# Altium schematic sheet MCU.SchDoc
size A4
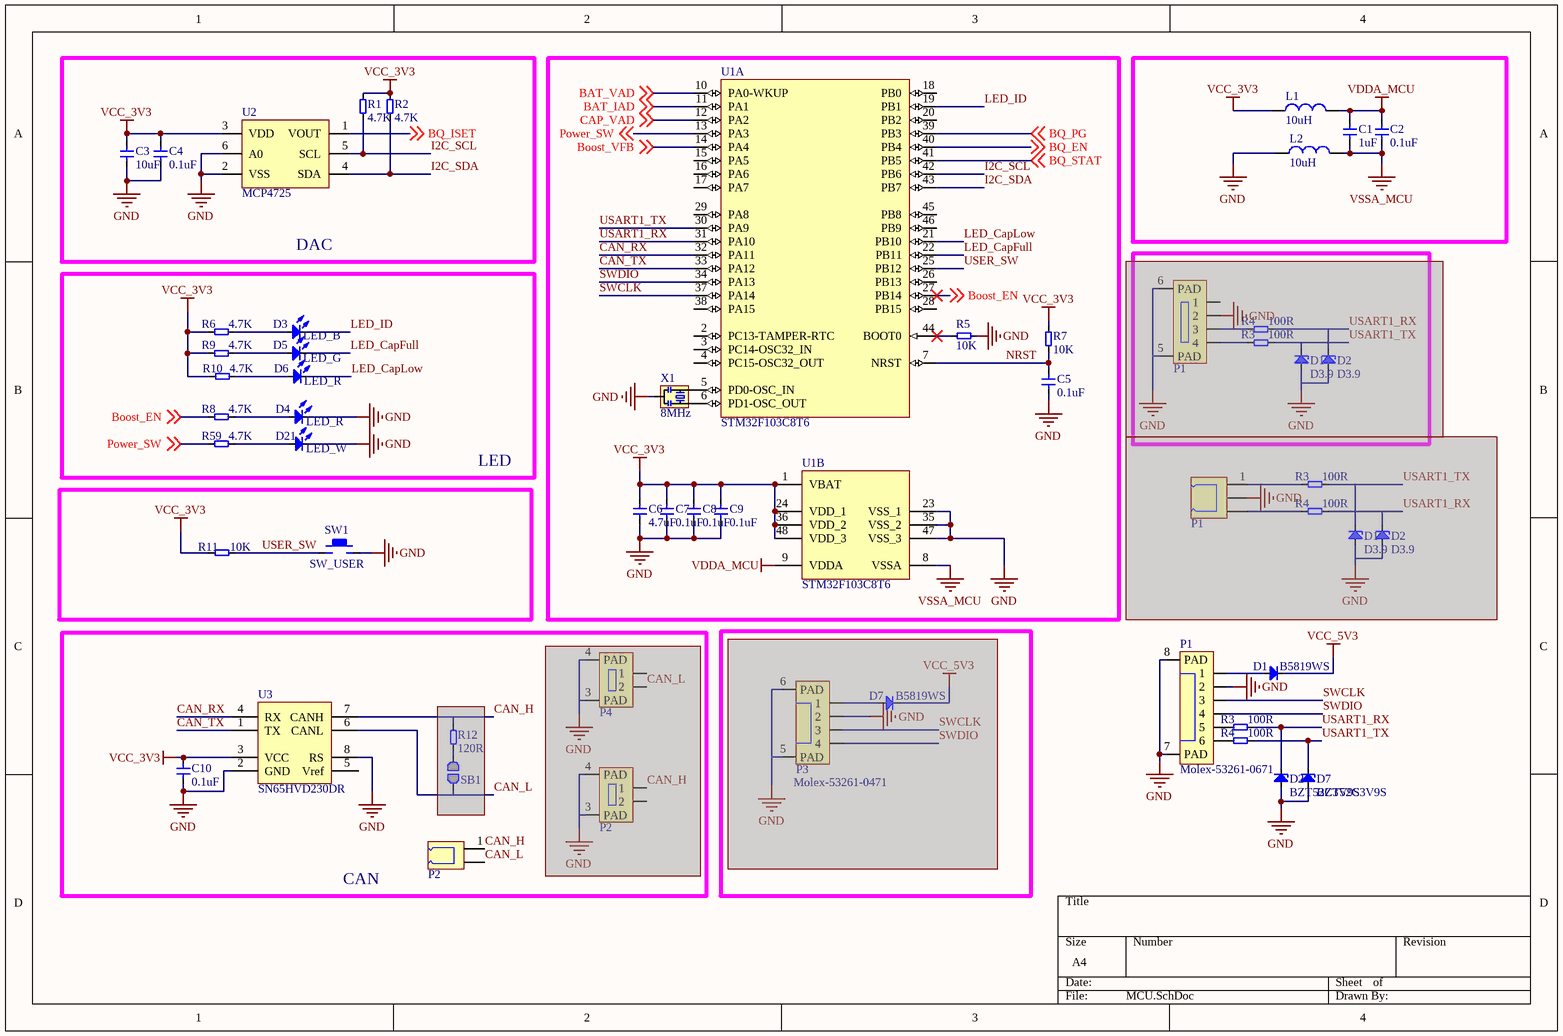
[diagram p0: MCU.SchDoc]

## Parts
(Parts that share a designator on the sheet are numbered #1, #2 ... from top to bottom, then left to right.)
C1  1uF  [CAP-0603-L]
C2  0.1uF  [CAP-0603-L]
C3  10uF  [CAP-0805-L]
C4  0.1uF  [CAP-0603-L]
C5  0.1uF  [CAP-0603-L]
C6  4.7uF  [CAP-0603-L]
C7  0.1uF  [CAP-0603-L]
C8  0.1uF  [CAP-0603-L]
C9  0.1uF  [CAP-0603-L]
C10  0.1uF  [CAP-0603-L]
D1#1  D3.9  [SOD_323]  (masked out: inside a compile mask, not in the netlist)
D1#2  D3.9  [SOD_323]  (masked out: inside a compile mask, not in the netlist)
D1#3  B5819WS  [SOD_323]
D2#1  D3.9  [SOD_323]  (masked out: inside a compile mask, not in the netlist)
D2#2  D3.9  [SOD_323]  (masked out: inside a compile mask, not in the netlist)
D2#3  BZT52C3V9S  [SOD_323]
D3  LED_B  [LED_0603-L]
D4  LED_R  [LED_0603-L]
D5  LED_G  [LED_0603-L]
D6  LED_R  [LED_0603-L]
D7#1  B5819WS  [SOD_323]  (masked out: inside a compile mask, not in the netlist)
D7#2  BZT52C3V9S  [SOD_323]
D21  LED_W  [LED_0603-L]
L1  10uH  [L-0603-L]
L2  10uH  [L-0603-L]
P1#1  GH04  [SM04B-GHS-TB]  (value not drawn)  (masked out: inside a compile mask, not in the netlist)
P1#2  XH_3  [XH_3-sleep]  (value not drawn)  (masked out: inside a compile mask, not in the netlist)
P1#3  Molex-53261-0671  [Molex-53261-0671]
P2#1  GH02  [SM02B-GHS-TB]  (value not drawn)  (masked out: inside a compile mask, not in the netlist)
P2#2  XH_2  [XH_2-SLEEP]  (value not drawn)
P3  Molex-53261-0471  [Molex-53261-0471]  (masked out: inside a compile mask, not in the netlist)
P4  GH02  [SM02B-GHS-TB]  (value not drawn)  (masked out: inside a compile mask, not in the netlist)
R1  4.7K  [R-0603-L]
R2  4.7K  [R-0603-L]
R3#1  100R  [R-0603-L]  (masked out: inside a compile mask, not in the netlist)
R3#2  100R  [R-0603-L]  (masked out: inside a compile mask, not in the netlist)
R3#3  100R  [R-0603-L]
R4#1  100R  [R-0603-L]  (masked out: inside a compile mask, not in the netlist)
R4#2  100R  [R-0603-L]  (masked out: inside a compile mask, not in the netlist)
R4#3  100R  [R-0603-L]
R5  10K  [R-0603-L]
R6  4.7K  [R-0603-L]
R7  10K  [R-0603-L]
R8  4.7K  [R-0603-L]
R9  4.7K  [R-0603-L]
R10  4.7K  [R-0603-L]
R11  10K  [R-0603-L]
R12  120R  [R-0603-L]  (masked out: inside a compile mask, not in the netlist)
R59  4.7K  [R-0603-L]
SB1  Solderbridge  [Solderbridge-0603]  (value not drawn)  (no BOM)  (masked out: inside a compile mask, not in the netlist)
SW1  SW_USER  [KEY-4P-4.2*3.4*2.5]
U1  STM32F103C8T6  [STM-LQFP48_N]  (parts A,B of 2)
U2  MCP4725  [SOT-23-6]
U3  SN65HVD230DR  [SOIC_8]
X1  8MHz  [CSTCE_G(A)村田晶振]

## Blocks framed on the sheet
DAC: C3 C4 R1 R2 U2
LED: D3-D6 D21 R6 R8-R10 R59
CAN: C10 P2#1 P2#2 P4 R12 SB1 U3

## Nets
GND: C3.1 C4.1 C5.1 C6.1 C7.1 C8.1 C9.1 C10.1 D2#3.1 D4.2 D7#2.1 D21.2 L2.1 P1#3.2 P1#3.7(PAD) P1#3.8(PAD) R5.2 SW1.1 U1.23(VSS_1) U1.35(VSS_2) U1.47(VSS_3) U2.2(VSS) U2.6(A0) U3.2(GND) U3.8(RS) X1.2(GND)
VCC_3V3: C3.2 C4.2 C6.2 C7.2 C8.2 C9.2 C10.2 L1.1 R1.2 R2.2 R6.1 R7.2 R9.1 R10.1 R11.1 U1.1(VBAT) U1.24(VDD_1) U1.36(VDD_2) U1.48(VDD_3) U2.3(VDD) U3.3(VCC)
VCC_5V3: D1#3.2
VDDA_MCU: C1.2 C2.2 L1.2 U1.9(VDDA)
VSSA_MCU: C1.1 C2.1 L2.2 U1.8(VSSA)
BAT_IAD: U1.11(PA1) ; off-sheet BAT_IAD
BAT_VAD: U1.10(PA0-WKUP) ; off-sheet BAT_VAD
Boost_EN: R8.1 U1.27(PB14) ; off-sheet Boost_EN
Boost_VFB: U1.14(PA4) ; off-sheet Boost_VFB
BQ_EN: U1.40(PB4) ; off-sheet BQ_EN
BQ_ISET: U2.1(VOUT) ; off-sheet BQ_ISET
BQ_PG: U1.39(PB3) ; off-sheet BQ_PG
BQ_STAT: U1.41(PB5) ; off-sheet BQ_STAT
CAN_H: P2#2.1 U3.7(CANH)
CAN_L: P2#2.2 U3.6(CANL)
CAN_RX: U1.32(PA11) U3.4(RX)
CAN_TX: U1.33(PA12) U3.1(TX)
CAP_VAD: U1.12(PA2) ; off-sheet CAP_VAD
I2C_SCL: R1.1 U1.42(PB6) U2.5(SCL)
I2C_SDA: R2.1 U1.43(PB7) U2.4(SDA)
LED_CapFull: D5.2 U1.22(PB11)
LED_CapLow: D6.2 U1.21(PB10)
LED_ID: D3.2 U1.19(PB1)
NRST: C5.2 R7.1 U1.7(NRST)
Power_SW: R59.1 U1.13(PA3) ; off-sheet Power_SW
SWCLK: P1#3.3 U1.37(PA14)
SWDIO: P1#3.4 U1.34(PA13)
USART1_RX: D2#3.2 R3#3.2 U1.31(PA10)
USART1_TX: D7#2.2 R4#3.2 U1.30(PA9)
USER_SW: R11.2 SW1.2 U1.25(PB12)
NetD1#3_1: D1#3.1 P1#3.1
NetD3_1: D3.1 R6.2
NetD4_1: D4.1 R8.2
NetD5_1: D5.1 R9.2
NetD6_1: D6.1 R10.2
NetD21_1: D21.1 R59.2
NetP1#3_5: P1#3.5 R3#3.1
NetP1#3_6: P1#3.6 R4#3.1
NetR5_1: R5.1 U1.44(BOOT0)
NetU1_5: U1.5(PD0-OSC_IN) X1.1(OSC1)
NetU1_6: U1.6(PD1-OSC_OUT) X1.3(OSC2)

Not connected (* = marked no-connect by the designer): U1 2(PC13-TAMPER-RTC) 3(PC14-OSC32_IN) 4(PC15-OSC32_OUT) 15(PA5) 16(PA6) 17(PA7) 18(PB0) 20(PB2) 26(PB13) 28(PB15) 29(PA8) 38(PA15) 45(PB8) 46(PB9); U3 5(Vref)

## Library data of the parts
C1-C10 = CAP
D1#1 D1#2 D2#1-D2#3 D7#2 = Diode_ZD
D1#3 D7#1 = Diode
D3-D6 D21 = LED
L1 L2 = Inductor: 电感
P1#1 = GHS-M04B: 04GH座
P1#3 = Molex-53261-0671: 1.25mm Pitch PicoBlade Header
P2#1 P4 = GHS-M02B: 02GH座
P3 = Molex-53261-0471: 1.25mm Pitch PicoBlade Header
R1 R2 R3#1-R3#3 R4#1-R4#3 R5-R12 R59 = Res
SW1 = KEY
U1 = STM32F103C8T6: ARM Cortex-M3 32-bit MCU, 64 KB Flash, 20 KB Internal RAM, 37 I/Os, 48-pin LQFP, -40 to 85 degC, Tray; A/D Converter: 2x12-bit (10 Channel); FLASH Size (Prog) (kB): 64; I/Os (High Current): 37; Internal RAM Size (kB): 20; Operating Frequency(F) (Processor speed) (MHz): 72; Supply Voltage(Vcc) min (V): 2; DatasheetVersion: Rev. 16; PackageVersion: Rev. 6, 06/2013; PackageReference: LQFP48; PackageDescription: 48-Pin Low Profile Quad Flat Package, 7 x 7 mm Body, 0.5 mm Pitch; Supplier 1: Digi-Key; Supplier Part Number 1: 497-6063-ND; Supplier 2: Farnell; Supplier Part Number 2: 1447637; Supplier 3: Newark; Supplier Part Number 3: 59M2182; Supplier 4: Newark; Supplier Part Number 4: 57P1222; Supplier 5: Mouser; Supplier Part Number 5: 511-STM32F103C8T6; Core: ARM Cortex-M3; Packing: Tray; Mounting Technology: Surface Mount; PartNumber: STM32F103C8T6; ComponentLink1Description: Manufacturer URL; ComponentLink1URL: http://www.st.com/web/en/home.html; ComponentLink2Description: Datasheet; ComponentLink2URL: http://www.st.com/st-web-ui/static/active/en/resource/technical/document/datasheet/CD00161566.pdf; ComponentLink3Description: Package Specification; ComponentLink3URL: http://www.st.com/st-web-ui/static/active/en/resource/technical/document/datasheet/DM00058181.pdf
U2 = MCP4725: I2C 12bit DAC
U3 = SN65HVD230DR: CAN芯片
X1 = XTAL-3215
SB1 = Solderbridge: Value: Solderbridge